# Altium schematic sheet supply_interface.SchDoc
size A4; SheetNumber: 3; SheetTotal: 5
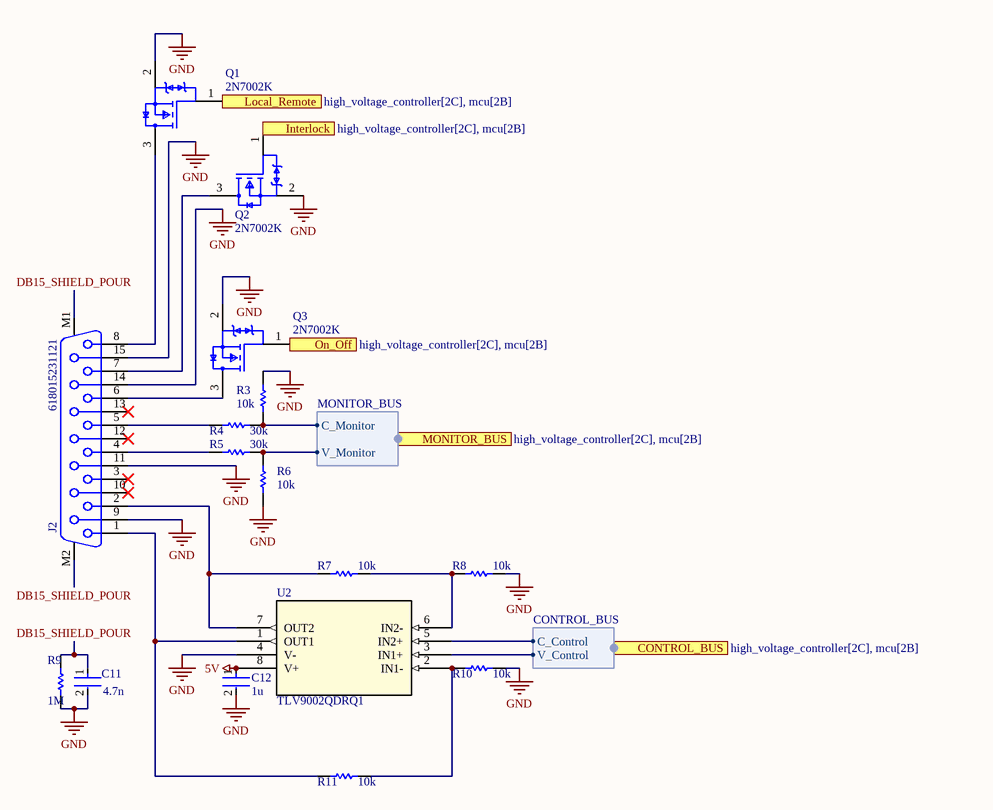
[diagram p0: supply_interface.SchDoc]

## Parts
C11  4.7n  [C_IM 0805]
C12  1u  [C_IM 0603]
J2  618015231121  [618015231121]
Q1  2N7002K  [SOT-23-3]
Q2  2N7002K  [SOT-23-3]
Q3  2N7002K  [SOT-23-3]
R3  10k  [R_IM 0805]
R4  30k  [R_IM 0805]
R5  30k  [R_IM 0805]
R6  10k  [R_IM 0805]
R7  10k  [R_IM 0805]
R8  10k  [R_IM 0805]
R9  1M  [R_IM 0805]
R10  10k  [R_IM 0805]
R11  10k  [R_IM 0805]
U2  TLV9002QDRQ1  [SOIC8_D_TEX]

## Ports
CONTROL_BUS (harness CONTROL_BUS, see high_voltage_controller[2C], mcu[2B]), Interlock (in, see high_voltage_controller[2C], mcu[2B]), Local_Remote (in, see high_voltage_controller[2C], mcu[2B]), MONITOR_BUS (harness MONITOR_BUS, see high_voltage_controller[2C], mcu[2B]), On_Off (in, see high_voltage_controller[2C], mcu[2B])

## Harnesses
MONITOR_BUS: C_Monitor, V_Monitor
CONTROL_BUS: C_Control, V_Control

## Nets
5V: C12.1 U2.8(V+)
GND: C11.2 C12.2 J2.9 J2.11 J2.14 J2.15 Q1.2(Source) Q2.2(Source) Q3.2(Source) R3.2 R6.1 R8.2 R9.1 R10.2 U2.4(V-)
DB15_SHIELD_POUR: C11.1 J2.M1 J2.M2 R9.2
Interlock: Q2.1(Gate) ; port Interlock
Local_Remote: Q1.1(Gate) ; port Local_Remote
On_Off: Q3.1(Gate) ; port On_Off
NetJ2_1: J2.1 R11.1 U2.1(OUT1)
NetJ2_2: J2.2 R7.1 U2.7(OUT2)
NetJ2_4: J2.4 R5.1
NetJ2_5: J2.5 R4.1
NetJ2_6: J2.6 Q3.3(Drain)
NetJ2_7: J2.7 Q2.3(Drain)
NetJ2_8: J2.8 Q1.3(Drain)
NetR3_1: R3.1 R4.2 ; port MONITOR_BUS.C_Monitor
NetR5_2: R5.2 R6.2 ; port MONITOR_BUS.V_Monitor
NetR7_2: R7.2 R8.1 U2.6(IN2-)
NetR10_1: R10.1 R11.2 U2.2(IN1-)
NetU2_3: U2.3(IN1+) ; port CONTROL_BUS.V_Control
NetU2_5: U2.5(IN2+) ; port CONTROL_BUS.C_Control

Not connected (* = marked no-connect by the designer): J2 3* 10* 12* 13*

## Library data of the parts
C11 = C0805C472KDRACAUTO: Cap Ceramic 0.0047uF 1000V X7R 10% Pad SMD 0805 125C Automotive AEC-Q200 Medical T/R; Manufacturer: Yageo Group; Value: 4.7nF; Voltage Rating (DC): 1kV; Supplier: DigiKey; Supplier Part Number: 399-16659-1-ND; Manufacturer Part Number: C0805C472KDRACAUTO; RoHS: Compliant; Category: Ceramic Capacitors; Stock: 30147; Pricing: 1=0.28, 10=0.165, 50=0.1198, 100=0.1059, 500=0.08234, 1000=0.07509 (USD); Case/Package: 0805; China RoHS: Compliant; Country of Origin: Mexico; Dielectric: X7R; Dielectric Material: Ceramic; Export Control Classification Number (ECCN) Code: EAR99; Height: 1.25mm; Harmonized Tariff Schedule (HTS) Code: 8532.24.00.20; Introduction Date: 2012-11-28; Length: 2mm; Lifecycle Status: Production; Max Operating Temperature: 125°C; Min Operating Temperature: -55°C; Mounting Technology: Surface Mount; Number of Terminals: 2; Ratings: AEC-Q200; REACH SVHC: Yes; Schedule B: 8532240020; Width: 1.25mm; ComponentLink1URL: https://datasheet.octopart.com:443/C0805C472KDRACAUTO-KEMET-datasheet-182037894.pdf?src-supplier=IHS; ComponentLink1Description: https://datasheet.octopart.com:443/C0805C472KDRACAUTO-KEMET-datasheet-182037894.pdf?src-supplier=IHS; ComponentLink2URL: https://datasheet.octopart.com:443/C0805C472KDRACAUTO-KEMET-datasheet-149524367.pdf?src-supplier=Farnell; ComponentLink2Description: https://datasheet.octopart.com:443/C0805C472KDRACAUTO-KEMET-datasheet-149524367.pdf?src-supplier=Farnell; ComponentLink3URL: https://datasheet.octopart.com:443/C0805C472KDRACAUTO-KEMET-datasheet-104412827.pdf?src-supplier=element14+APAC; ComponentLink3Description: https://datasheet.octopart.com:443/C0805C472KDRACAUTO-KEMET-datasheet-104412827.pdf?src-supplier=element14+APAC; ComponentLink4URL: https://datasheet.octopart.com:443/C0805C472KDRACAUTO-KEMET-datasheet-176334439.pdf?src-supplier=Newark; ComponentLink4Description: https://datasheet.octopart.com:443/C0805C472KDRACAUTO-KEMET-datasheet-176334439.pdf?src-supplier=Newark; ComponentLink5URL: https://datasheet.octopart.com/C0805C472KDRACAUTO-KEMET-datasheet-84169754.pdf; ComponentLink5Description: https://datasheet.octopart.com/C0805C472KDRACAUTO-KEMET-datasheet-84169754.pdf; Supplier 1: DigiKey; Supplier Part Number 1: 399-16659-1-ND
C12 = CC0603KRX7R7BB105: 16V 1uF X7R ±10% 0603 Multilayer Ceramic Capacitors MLCC - SMD/SMT ROHS; Manufacturer: Yageo Group; Value: 1µF; Dissipation Factor: 5%; Supplier: DigiKey; Supplier Part Number: 311-1446-1-ND; Manufacturer Part Number: CC0603KRX7R7BB105; RoHS: Compliant; Category: Ceramic Capacitors; Stock: 6886746; Pricing: 1=0.13, 10=0.073, 50=0.0508, 100=0.044, 500=0.0327, 1000=0.02922 (USD); Case/Package: 0603; Case Code (Imperial): 0603; Case Code (Metric): 1608; China RoHS: Compliant; Composition: Ceramic; Country of Origin: Mainland China, Taiwan; Depth: 800µm; Dielectric: X7R; Dielectric Material: Ceramic; Export Control Classification Number (ECCN) Code: EAR99; Halogen Free: Halogen Free; Height: 800µm; Harmonized Tariff Schedule (HTS) Code: 8532.24.00.20; Introduction Date: 2009-04-17; Lead Free: Lead Free; Length: 1.6mm; Lifecycle Status: Production; Material: Ceramic; Max Operating Temperature: 125°C; Min Operating Temperature: -55°C; Mounting Technology: Surface Mount; Pins: 2; Number of Terminals: 2; Radiation Hardening: No; REACH SVHC: Yes; Schedule B: 8532240020, 8532240020|8532240020, 8532240020|8532240020|8532240020, 8532240020|8532240020|8532240020|8532240020; Termination: SMD/SMT; Thickness: 889µm; Tolerance: 10%; Voltage: 16V; Voltage Rating: 16V; Voltage Rating (DC): 16V; Width: 800µm; ComponentLink1URL: https://datasheet.octopart.com:443/CC0603KRX7R7BB105-Yageo-datasheet-177165144.pdf?src-supplier=IHS; ComponentLink1Description: https://datasheet.octopart.com:443/CC0603KRX7R7BB105-Yageo-datasheet-177165144.pdf?src-supplier=IHS; ComponentLink2URL: https://datasheet.octopart.com:443/CC0603KRX7R7BB105-Yageo-datasheet-82288757.pdf?src-supplier=Upverter; ComponentLink2Description: https://datasheet.octopart.com:443/CC0603KRX7R7BB105-Yageo-datasheet-82288757.pdf?src-supplier=Upverter; ComponentLink3URL: https://datasheet.octopart.com/CC0603KRX7R7BB105-Yageo-datasheet-10883670.pdf; ComponentLink3Description: https://datasheet.octopart.com/CC0603KRX7R7BB105-Yageo-datasheet-10883670.pdf; ComponentLink4URL: https://datasheet.octopart.com/CC0603KRX7R7BB105-Yageo-datasheet-12526321.pdf; ComponentLink4Description: https://datasheet.octopart.com/CC0603KRX7R7BB105-Yageo-datasheet-12526321.pdf; ComponentLink5URL: https://datasheet.octopart.com:443/CC0603KRX7R7BB105-Yageo-datasheet-181968648.pdf?src-supplier=Newark; ComponentLink5Description: https://datasheet.octopart.com:443/CC0603KRX7R7BB105-Yageo-datasheet-181968648.pdf?src-supplier=Newark; ComponentLink6URL: https://datasheet.octopart.com:443/CC0603KRX7R7BB105-Yageo-datasheet-181968639.pdf?src-supplier=Newark; ComponentLink6Description: https://datasheet.octopart.com:443/CC0603KRX7R7BB105-Yageo-datasheet-181968639.pdf?src-supplier=Newark; ComponentLink7URL: https://datasheet.octopart.com:443/CC0603KRX7R7BB105-Yageo-datasheet-519481.pdf?src-supplier=Newark; ComponentLink7Description: https://datasheet.octopart.com:443/CC0603KRX7R7BB105-Yageo-datasheet-519481.pdf?src-supplier=Newark; ComponentLink8URL: https://datasheet.octopart.com:443/CC0603KRX7R7BB105-Yageo-datasheet-147453679.pdf?src-supplier=Newark; ComponentLink8Description: https://datasheet.octopart.com:443/CC0603KRX7R7BB105-Yageo-datasheet-147453679.pdf?src-supplier=Newark; ComponentLink9URL: https://datasheet.octopart.com:443/CC0603KRX7R7BB105-Yageo-datasheet-62336348.pdf?src-supplier=Farnell; ComponentLink9Description: https://datasheet.octopart.com:443/CC0603KRX7R7BB105-Yageo-datasheet-62336348.pdf?src-supplier=Farnell; ComponentLink10URL: https://datasheet.octopart.com:443/CC0603KRX7R7BB105-Yageo-datasheet-151948686.pdf?src-supplier=Farnell; ComponentLink10Description: https://datasheet.octopart.com:443/CC0603KRX7R7BB105-Yageo-datasheet-151948686.pdf?src-supplier=Farnell; ComponentLink11URL: https://datasheet.octopart.com:443/CC0603KRX7R7BB105-Yageo-datasheet-15895757.pdf?src-supplier=element14+APAC; ComponentLink11Description: https://datasheet.octopart.com:443/CC0603KRX7R7BB105-Yageo-datasheet-15895757.pdf?src-supplier=element14+APAC; ComponentLink12URL: https://datasheet.octopart.com:443/CC0603KRX7R7BB105-Yageo-datasheet-166511530.pdf?src-supplier=Future+Electronics; ComponentLink12Description: https://datasheet.octopart.com:443/CC0603KRX7R7BB105-Yageo-datasheet-166511530.pdf?src-supplier=Future+Electronics; ComponentLink13URL: https://datasheet.octopart.com:443/CC0603KRX7R7BB105-Yageo-datasheet-137700082.pdf?src-supplier=Future+Electronics; ComponentLink13Description: https://datasheet.octopart.com:443/CC0603KRX7R7BB105-Yageo-datasheet-137700082.pdf?src-supplier=Future+Electronics; ComponentLink14URL: https://datasheet.octopart.com:443/CC0603KRX7R7BB105-Yageo-datasheet-137700084.pdf?src-supplier=Future+Electronics; ComponentLink14Description: https://datasheet.octopart.com:443/CC0603KRX7R7BB105-Yageo-datasheet-137700084.pdf?src-supplier=Future+Electronics; ComponentLink15URL: https://datasheet.octopart.com:443/CC0603KRX7R7BB105-Yageo-datasheet-27626582.pdf?src-supplier=Future+Electronics; ComponentLink15Description: https://datasheet.octopart.com:443/CC0603KRX7R7BB105-Yageo-datasheet-27626582.pdf?src-supplier=Future+Electronics; ComponentLink16URL: https://datasheet.octopart.com:443/CC0603KRX7R7BB105-Yageo-Group-datasheet-165992755.pdf?src-supplier=ODG+(Origin+Data+Global); ComponentLink16Description: https://datasheet.octopart.com:443/CC0603KRX7R7BB105-Yageo-Group-datasheet-165992755.pdf?src-supplier=ODG+(Origin+Data+Global); ComponentLink17URL: https://datasheet.octopart.com:443/CC0603KRX7R7BB105-Yageo-datasheet-140260305.pdf?src-supplier=SOS+electronic; ComponentLink17Description: https://datasheet.octopart.com:443/CC0603KRX7R7BB105-Yageo-datasheet-140260305.pdf?src-supplier=SOS+electronic; ComponentLink18URL: https://datasheet.octopart.com:443/CC0603KRX7R7BB105-Yageo-datasheet-8701427.pdf?src-supplier=element14; ComponentLink18Description: https://datasheet.octopart.com:443/CC0603KRX7R7BB105-Yageo-datasheet-8701427.pdf?src-supplier=element14; ComponentLink19URL: https://datasheet.octopart.com:443/CC0603KRX7R7BB105-Yageo-datasheet-499490.pdf?src-supplier=element14; ComponentLink19Description: https://datasheet.octopart.com:443/CC0603KRX7R7BB105-Yageo-datasheet-499490.pdf?src-supplier=element14; ComponentLink20URL: https://datasheet.octopart.com:443/CC0603KRX7R7BB105-Yageo-datasheet-5301394.pdf?src-supplier=element14; ComponentLink20Description: https://datasheet.octopart.com:443/CC0603KRX7R7BB105-Yageo-datasheet-5301394.pdf?src-supplier=element14; ComponentLink21URL: https://datasheet.octopart.com:443/CC0603KRX7R7BB105-Yageo-datasheet-17600895.pdf?src-supplier=TME; ComponentLink21Description: https://datasheet.octopart.com:443/CC0603KRX7R7BB105-Yageo-datasheet-17600895.pdf?src-supplier=TME; ComponentLink22URL: http://sigma.octopart.com:80/rohs_statement/Surface-Mount-Ceramic-Multilayer-Capacitors%3B-General-Purpose-%26-High-Capacitance-Class-2%2C-X7R-Yageo-family-124.pdf?src-supplier=Compliance+Statements; ComponentLink22Description: http://sigma.octopart.com:80/rohs_statement/Surface-Mount-Ceramic-Multilayer-Capacitors%3B-General-Purpose-%26-High-Capacitance-Class-2%2C-X7R-Yageo-family-124.pdf?src-supplier=Compliance+Statements; ComponentLink23URL: http://sigma.octopart.com:80/reach_statement/Surface-Mount-Ceramic-Multilayer-Capacitors%3B-General-Purpose-%26-High-Capacitance-Class-2%2C-X7R-Yageo-family-125.pdf?src-supplier=Compliance+Statements; ComponentLink23Description: http://sigma.octopart.com:80/reach_statement/Surface-Mount-Ceramic-Multilayer-Capacitors%3B-General-Purpose-%26-High-Capacitance-Class-2%2C-X7R-Yageo-family-125.pdf?src-supplier=Compliance+Statements; ComponentLink24URL: http://sigma.octopart.com:80/conflict_mineral_statement/Yageo-company-3.pdf?src-supplier=Compliance+Statements; ComponentLink24Description: http://sigma.octopart.com:80/conflict_mineral_statement/Yageo-company-3.pdf?src-supplier=Compliance+Statements; ComponentLink25URL: http://sigma.octopart.com:80/rohs_statement/Yageo-company-2.pdf?src-supplier=Compliance+Statements; ComponentLink25Description: http://sigma.octopart.com:80/rohs_statement/Yageo-company-2.pdf?src-supplier=Compliance+Statements; Supplier 1: DigiKey; Supplier Part Number 1: 311-1446-1-ND
J2 = 618015231121: 15 Way Right Angle Through Hole Pcb D-sub Connector Socket, 2.77MM, 2.84MM Pitch; Manufacturer: Wurth Elektronik; Manufacturer Lifecycle Status: ACTIVE; Contact Resistance: 30mΩ; Current Rating: 3A; Gender: Female; Insulation Resistance: 5GΩ; Number of Contacts: 15; Operating Supply Voltage: 125V; YEOL: 1 = Estimated lifetime > 10 years; Supplier: DigiKey; Supplier Part Number: 732-618015231121-ND; Manufacturer Part Number: 618015231121; RoHS: Compliant; Category: D-Sub Connectors; Stock: 1853; Pricing: 1=4.07, 10=3.857, 50=3.4296, 100=2.9925, 250=2.565, 500=2.2895 (USD); Contact Plating: Gold; Depth: 18.5mm; Housing Material: Steel; Insulation Material: PBT; Length: 24.8mm; Lifecycle Status: Production; Max Operating Temperature: 105°C; Min Operating Temperature: -55°C; Mounting Technology: Through Hole; Pins: 15; Number of Rows: 2; Orientation: Right Angle; Pitch: 2.77mm; Termination: SMD/SMT; Voltage Rating: 125V; Width: 12.5mm; ComponentLink1URL: https://datasheet.octopart.com:443/618015231121-W%C3%BCrth-Elektronik-datasheet-149524395.pdf?src-supplier=Wurth+Elektronik; ComponentLink1Description: https://datasheet.octopart.com:443/618015231121-W%C3%BCrth-Elektronik-datasheet-149524395.pdf?src-supplier=Wurth+Elektronik; ComponentLink2URL: https://datasheet.octopart.com:443/618015231121-W%C3%BCrth-Elektronik-datasheet-111088018.pdf?src-supplier=Wurth+Elektronik; ComponentLink2Description: https://datasheet.octopart.com:443/618015231121-W%C3%BCrth-Elektronik-datasheet-111088018.pdf?src-supplier=Wurth+Elektronik; ComponentLink3URL: https://datasheet.octopart.com:443/618015231121-W%C3%BCrth-Elektronik-Midcom-datasheet-10410299.pdf?src-supplier=Newark; ComponentLink3Description: https://datasheet.octopart.com:443/618015231121-W%C3%BCrth-Elektronik-Midcom-datasheet-10410299.pdf?src-supplier=Newark; ComponentLink4URL: https://datasheet.octopart.com:443/618015231121-W%C3%BCrth-Elektronik-Midcom-datasheet-10413304.pdf?src-supplier=element14+APAC; ComponentLink4Description: https://datasheet.octopart.com:443/618015231121-W%C3%BCrth-Elektronik-Midcom-datasheet-10413304.pdf?src-supplier=element14+APAC; ComponentLink5URL: https://datasheet.octopart.com:443/618015231121-W%C3%BCrth-Elektronik-Midcom-datasheet-10470155.pdf?src-supplier=element14+APAC; ComponentLink5Description: https://datasheet.octopart.com:443/618015231121-W%C3%BCrth-Elektronik-Midcom-datasheet-10470155.pdf?src-supplier=element14+APAC; ComponentLink6URL: https://datasheet.octopart.com:443/618015231121-W%C3%BCrth-Elektronik-Midcom-datasheet-10489568.pdf?src-supplier=Farnell; ComponentLink6Description: https://datasheet.octopart.com:443/618015231121-W%C3%BCrth-Elektronik-Midcom-datasheet-10489568.pdf?src-supplier=Farnell; Supplier 1: DigiKey; Supplier Part Number 1: 732-618015231121-ND
Q1-Q3 = 2N7002K: Mosfet N-ch 60V 300MA SOT23 / Trans Mosfet N-ch 60V 0.3A 3-PIN SOT-23 T/r; Manufacturer: onsemi; Manufacturer Lifecycle Status: ACTIVE; Continuous Drain Current (ID): 115mA; Current: 3A; Drain to Source Resistance: 2Ω; Element Configuration: Single; Gate to Source Voltage (Vgs): 20V; Input Capacitance: 50pF; Max Junction Temperature (Tj): 150°C; Max Power Dissipation: 350W; Number of Channels: 1; Power Dissipation: 300mW; Value: 2Ω; Threshold Voltage: 2.5V; Turn-Off Delay Time: 55.8ns; Turn-On Delay Time: 12.2ns; Supplier: DigiKey; Supplier Part Number: 2N7002KCT-ND; Manufacturer Part Number: 2N7002K; RoHS: Compliant; Category: MOSFETs; Stock: 393574; Pricing: 1=0.33, 10=0.203, 100=0.1271, 500=0.09384, 1000=0.08309 (USD); Case/Package: SOT-23; China RoHS: Compliant; Contact Plating: Tin; Drain to Source Breakdown Voltage: 60V; Drain to Source Voltage (Vdss): 60V; Height: 1.11mm; Lead Free: Lead Free; Length: 2.92mm; Lifecycle Status: Production; Max Operating Temperature: 150°C; Min Breakdown Voltage: 60V; Min Operating Temperature: -55°C; Mounting Technology: Surface Mount; Number of Elements: 1; Pins: 3; Number of Terminals: 3; Radiation Hardening: No; Rds On Max: 2Ω; REACH SVHC: Yes; Schedule B: 8541210080, 8541210080|8541210080|8541210080|8541210080|8541210080; Voltage: 60V; Width: 1.3mm; ComponentLink1URL: https://datasheet.octopart.com:443/2N7002K-onsemi-datasheet-180957336.pdf?src-supplier=IHS; ComponentLink1Description: https://datasheet.octopart.com:443/2N7002K-onsemi-datasheet-180957336.pdf?src-supplier=IHS; ComponentLink2URL: https://datasheet.octopart.com:443/2N7002K-Fairchild-Semiconductor-datasheet-34208596.pdf?src-supplier=IHS; ComponentLink2Description: https://datasheet.octopart.com:443/2N7002K-Fairchild-Semiconductor-datasheet-34208596.pdf?src-supplier=IHS; ComponentLink3URL: https://datasheet.octopart.com:443/2N7002K-ON-Semiconductor-datasheet-138897972.pdf?src-supplier=onsemi; ComponentLink3Description: https://datasheet.octopart.com:443/2N7002K-ON-Semiconductor-datasheet-138897972.pdf?src-supplier=onsemi; ComponentLink4URL: https://datasheet.octopart.com:443/2N7002K-ON-Semiconductor-datasheet-147841327.pdf?src-supplier=onsemi; ComponentLink4Description: https://datasheet.octopart.com:443/2N7002K-ON-Semiconductor-datasheet-147841327.pdf?src-supplier=onsemi; ComponentLink5URL: https://datasheet.octopart.com:443/2N7002K-ON-Semiconductor-datasheet-81464098.pdf?src-supplier=onsemi; ComponentLink5Description: https://datasheet.octopart.com:443/2N7002K-ON-Semiconductor-datasheet-81464098.pdf?src-supplier=onsemi; ComponentLink6URL: https://datasheet.octopart.com:443/2N7002K-ON-Semiconductor-datasheet-8636720.pdf?src-supplier=onsemi; ComponentLink6Description: https://datasheet.octopart.com:443/2N7002K-ON-Semiconductor-datasheet-8636720.pdf?src-supplier=onsemi; ComponentLink7URL: https://sigma.octopart.com:443/138897241/technical_drawing/ON-Semiconductor-2N7002K.pdf?src-supplier=Upverter; ComponentLink7Description: https://sigma.octopart.com:443/138897241/technical_drawing/ON-Semiconductor-2N7002K.pdf?src-supplier=Upverter; ComponentLink8URL: https://datasheet.octopart.com:443/2N7002K-ON-Semiconductor-datasheet-13704821.pdf?src-supplier=element14+APAC; ComponentLink8Description: https://datasheet.octopart.com:443/2N7002K-ON-Semiconductor-datasheet-13704821.pdf?src-supplier=element14+APAC; ComponentLink9URL: https://datasheet.octopart.com:443/2N7002K-ON-Semiconductor-datasheet-86682065.pdf?src-supplier=element14+APAC; ComponentLink9Description: https://datasheet.octopart.com:443/2N7002K-ON-Semiconductor-datasheet-86682065.pdf?src-supplier=element14+APAC; ComponentLink10URL: https://datasheet.octopart.com:443/2N7002K-onsemi-datasheet-181958640.pdf?src-supplier=Newark; ComponentLink10Description: https://datasheet.octopart.com:443/2N7002K-onsemi-datasheet-181958640.pdf?src-supplier=Newark; ComponentLink11URL: https://datasheet.octopart.com:443/2N7002K-Fairchild-Semiconductor-datasheet-67650041.pdf?src-supplier=Newark; ComponentLink11Description: https://datasheet.octopart.com:443/2N7002K-Fairchild-Semiconductor-datasheet-67650041.pdf?src-supplier=Newark; ComponentLink12URL: https://datasheet.octopart.com:443/2N7002K-Fairchild-Semiconductor-datasheet-68365086.pdf?src-supplier=Newark; ComponentLink12Description: https://datasheet.octopart.com:443/2N7002K-Fairchild-Semiconductor-datasheet-68365086.pdf?src-supplier=Newark; ComponentLink13URL: https://datasheet.octopart.com:443/2N7002K-Fairchild-Semiconductor-datasheet-68558619.pdf?src-supplier=Newark; ComponentLink13Description: https://datasheet.octopart.com:443/2N7002K-Fairchild-Semiconductor-datasheet-68558619.pdf?src-supplier=Newark; ComponentLink14URL: https://datasheet.octopart.com:443/2N7002K-ON-Semiconductor-datasheet-137315652.pdf?src-supplier=Future+Electronics; ComponentLink14Description: https://datasheet.octopart.com:443/2N7002K-ON-Semiconductor-datasheet-137315652.pdf?src-supplier=Future+Electronics; ComponentLink15URL: https://sigma.octopart.com:443/17343971/technical_drawing/Fairchild-Semiconductor-2N7002K.pdf?src-supplier=Fairchild+Semiconductor; ComponentLink15Description: https://sigma.octopart.com:443/17343971/technical_drawing/Fairchild-Semiconductor-2N7002K.pdf?src-supplier=Fairchild+Semiconductor; ComponentLink16URL: https://datasheet.octopart.com:443/2N7002K-Fairchild-Semiconductor-datasheet-67878677.pdf?src-supplier=Farnell; ComponentLink16Description: https://datasheet.octopart.com:443/2N7002K-Fairchild-Semiconductor-datasheet-67878677.pdf?src-supplier=Farnell; ComponentLink17URL: https://datasheet.octopart.com:443/2N7002K-Fairchild-Semiconductor-datasheet-68650436.pdf?src-supplier=Farnell; ComponentLink17Description: https://datasheet.octopart.com:443/2N7002K-Fairchild-Semiconductor-datasheet-68650436.pdf?src-supplier=Farnell; ComponentLink18URL: https://datasheet.octopart.com:443/2N7002K-Fairchild-Semiconductor-datasheet-78857226.pdf?src-supplier=Farnell; ComponentLink18Description: https://datasheet.octopart.com:443/2N7002K-Fairchild-Semiconductor-datasheet-78857226.pdf?src-supplier=Farnell; ComponentLink19URL: http://sigma.octopart.com:80/150600003/rohs_statement/ON-Semiconductor-2N7002K.pdf?src-supplier=Compliance+Statements; ComponentLink19Description: http://sigma.octopart.com:80/150600003/rohs_statement/ON-Semiconductor-2N7002K.pdf?src-supplier=Compliance+Statements; ComponentLink20URL: http://sigma.octopart.com:80/17343977/reach_statement/Fairchild-Semiconductor-2N7002K.pdf?src-supplier=Compliance+Statements; ComponentLink20Description: http://sigma.octopart.com:80/17343977/reach_statement/Fairchild-Semiconductor-2N7002K.pdf?src-supplier=Compliance+Statements; ComponentLink21URL: http://sigma.octopart.com:80/17343978/materials_sheet/Fairchild-Semiconductor-2N7002K.pdf?src-supplier=Compliance+Statements; ComponentLink21Description: http://sigma.octopart.com:80/17343978/materials_sheet/Fairchild-Semiconductor-2N7002K.pdf?src-supplier=Compliance+Statements; ComponentLink22URL: http://sigma.octopart.com:80/33036988/materials_sheet/Fairchild-Semiconductor-2N7002K.pdf?src-supplier=Compliance+Statements; ComponentLink22Description: http://sigma.octopart.com:80/33036988/materials_sheet/Fairchild-Semiconductor-2N7002K.pdf?src-supplier=Compliance+Statements; ComponentLink23URL: http://sigma.octopart.com:80/33036987/reach_statement/Fairchild-Semiconductor-2N7002K.pdf?src-supplier=Compliance+Statements; ComponentLink23Description: http://sigma.octopart.com:80/33036987/reach_statement/Fairchild-Semiconductor-2N7002K.pdf?src-supplier=Compliance+Statements; ComponentLink24URL: http://sigma.octopart.com:80/reach_statement/ON-Semiconductor-company-79.pdf?src-supplier=Compliance+Statements; ComponentLink24Description: http://sigma.octopart.com:80/reach_statement/ON-Semiconductor-company-79.pdf?src-supplier=Compliance+Statements; ComponentLink25URL: http://sigma.octopart.com:80/rohs_statement/Fairchild-Semiconductor-company-11.pdf?src-supplier=Compliance+Statements; ComponentLink25Description: http://sigma.octopart.com:80/rohs_statement/Fairchild-Semiconductor-company-11.pdf?src-supplier=Compliance+Statements; ComponentLink26URL: http://sigma.octopart.com:80/rohs_statement/Fairchild-Semiconductor-company-10.pdf?src-supplier=Compliance+Statements; ComponentLink26Description: http://sigma.octopart.com:80/rohs_statement/Fairchild-Semiconductor-company-10.pdf?src-supplier=Compliance+Statements; ComponentLink27URL: http://sigma.octopart.com:80/reach_statement/Fairchild-Semiconductor-company-9.pdf?src-supplier=Compliance+Statements; ComponentLink27Description: http://sigma.octopart.com:80/reach_statement/Fairchild-Semiconductor-company-9.pdf?src-supplier=Compliance+Statements; ComponentLink28URL: https://octopart.com:443/opatz8j6/c1?t=nm5kdMlbaAnwpklrVZblZ0nE71AQlgwh7ERqQoEJhKvEfgRp_9FXj7IMoPPC8V_j13LWXOpO2Jxw4bOkneI3J4oQ-Ueqca9fxYR6kFJosDJCZUuoEPm8PptoZzKZNXIWwYdL1v0f_3jxmMMd6AmYg9Y7R4OLdY3QL6Rk6u6ai-3ss5V1K0SdYAJs7A9F18xCMj7KK3OJ0kjjq8to-n9XtuWqv7DBv7T5vrdVNUg03mJ5ApziGpyAB5Qe7qbvoVw8pQA7F0WEglJk1PRa4-p6s3a5dQiLDUC_bYLpYK_Y4Yhi_XqAGpD62eBhzZC41UC6OOQBzi0Qvg0NEKn45CaGve0MJuREN5MOXiQU&src-supplier=Compliance+Statements; ComponentLink28Description: https://octopart.com:443/opatz8j6/c1?t=nm5kdMlbaAnwpklrVZblZ0nE71AQlgwh7ERqQoEJhKvEfgRp_9FXj7IMoPPC8V_j13LWXOpO2Jxw4bOkneI3J4oQ-Ueqca9fxYR6kFJosDJCZUuoEPm8PptoZzKZNXIWwYdL1v0f_3jxmMMd6AmYg9Y7R4OLdY3QL6Rk6u6ai-3ss5V1K0SdYAJs7A9F18xCMj7KK3OJ0kjjq8to-n9XtuWqv7DBv7T5vrdVNUg03mJ5ApziGpyAB5Qe7qbvoVw8pQA7F0WEglJk1PRa4-p6s3a5dQiLDUC_bYLpYK_Y4Yhi_XqAGpD62eBhzZC41UC6OOQBzi0Qvg0NEKn45CaGve0MJuREN5MOXiQU&src-supplier=Compliance+Statements; ComponentLink29URL: https://octopart.com:443/opatz8j6/c1?t=yP1dprRIHwIgdvtjb9FYqRaP3_9HWgrBaL9JkhjecsSuf0n6cINMsFwp5N6FMygctrzVDOAIh4pqo1B7NhLuP4EfhfgMmii0srxvh2XxIZc2UWh74_aW-dJirl-sIPHhCpS4y3FsLHcYkfI7uz7Zobk3yF8mMTCkQ2uO5Ev9E03_1hZh6X3YtwOYI82JGjIbo8QvUN_FXJ9Womd2nii1m-sUjS3nWbw_QaYVMn5ZbNRqutWyxY-yUPVqm24VyLJbSNi-am4bjCcC6TDsH0hBYj3fGvqNFGx_58D2X5w3EoEA4KlvTi0mcDs5gj__gSGJCxXMmsSQPns7LYMZtqXHHcrx3ZG_xUyLjZk&src-supplier=Compliance+Statements; ComponentLink29Description: https://octopart.com:443/opatz8j6/c1?t=yP1dprRIHwIgdvtjb9FYqRaP3_9HWgrBaL9JkhjecsSuf0n6cINMsFwp5N6FMygctrzVDOAIh4pqo1B7NhLuP4EfhfgMmii0srxvh2XxIZc2UWh74_aW-dJirl-sIPHhCpS4y3FsLHcYkfI7uz7Zobk3yF8mMTCkQ2uO5Ev9E03_1hZh6X3YtwOYI82JGjIbo8QvUN_FXJ9Womd2nii1m-sUjS3nWbw_QaYVMn5ZbNRqutWyxY-yUPVqm24VyLJbSNi-am4bjCcC6TDsH0hBYj3fGvqNFGx_58D2X5w3EoEA4KlvTi0mcDs5gj__gSGJCxXMmsSQPns7LYMZtqXHHcrx3ZG_xUyLjZk&src-supplier=Compliance+Statements; Supplier 1: DigiKey; Supplier Part Number 1: 2N7002KCT-ND
R3 R6-R8 R10 R11 = RC0805FR-0710KL: Res General Purpose Thick Film 0805 10k Ohm 1% 1/8W ±100ppm/°C Ceramic Paper T/R; Manufacturer: Yageo Group; Max Power Dissipation: 125mW; Value: 10kΩ; Voltage Rating: 150V; Supplier: DigiKey; Supplier Part Number: 311-10.0KCRCT-ND; Manufacturer Part Number: RC0805FR-0710KL; RoHS: Compliant; Category: Chip SMD Resistors; Stock: 4083661; Pricing: 1=0.1, 10=0.034, 25=0.0256, 50=0.0208, 100=0.0171, 250=0.01344, 500=0.01136, 1000=0.00973 (USD); Case/Package: 0805; Case Code (Imperial): 0805; China RoHS: Non-Compliant; Composition: Thick Film; Contact Plating: Tin; Country of Origin: Mainland China, Taiwan; Depth: 1.25mm; Export Control Classification Number (ECCN) Code: EAR99; Features: Moisture Resistant; Height: 500µm; Harmonized Tariff Schedule (HTS) Code: 8533.21.00.30; Introduction Date: 2004-09-22; Lead Free: Lead Free; Length: 2mm; Lifecycle Status: Production; Max Operating Temperature: 155°C; Military Standard: Not; Min Operating Temperature: -55°C; Mounting Technology: Surface Mount; Pins: 2; Number of Terminals: 2; Number of Terminations: 2; Packaging: Tape and Reel; Power Rating: 125mW; Radiation Hardening: No; REACH SVHC: Yes; Schedule B: 8533210045, 8533210045|8533210045|8533210045|8533210045|8533210045|8533210045|8533210045|8533210045|8533210045|8533210045|8533210045|8533210045|8533210045|8533210045|8533210045|8533210045|8533210045|8533210045|8533210045|8533210045|8533210045|8533210045|8533210045|85; Temperature Coefficient: 100ppm/°C; Termination: SMD/SMT; Tolerance: 1%; Voltage Rating (AC): 150V; Voltage Rating (DC): 150V; Width: 1.25mm; Working Voltage: 150V; ComponentLink1URL: https://datasheet.octopart.com:443/RC0805FR-0710KL-Yageo-datasheet-175887523.pdf?src-supplier=Newark; ComponentLink1Description: https://datasheet.octopart.com:443/RC0805FR-0710KL-Yageo-datasheet-175887523.pdf?src-supplier=Newark; ComponentLink2URL: https://datasheet.octopart.com:443/RC0805FR-0710KL-Yageo-datasheet-62067350.pdf?src-supplier=Farnell; ComponentLink2Description: https://datasheet.octopart.com:443/RC0805FR-0710KL-Yageo-datasheet-62067350.pdf?src-supplier=Farnell; ComponentLink3URL: https://datasheet.octopart.com:443/RC0805FR-0710KL-Yageo-datasheet-13691069.pdf?src-supplier=Farnell; ComponentLink3Description: https://datasheet.octopart.com:443/RC0805FR-0710KL-Yageo-datasheet-13691069.pdf?src-supplier=Farnell; ComponentLink4URL: https://datasheet.octopart.com:443/RC0805FR-0710KL-Yageo-datasheet-103092701.pdf?src-supplier=Upverter; ComponentLink4Description: https://datasheet.octopart.com:443/RC0805FR-0710KL-Yageo-datasheet-103092701.pdf?src-supplier=Upverter; ComponentLink5URL: https://datasheet.octopart.com:443/RC0805FR-0710KL-Yageo-datasheet-98239111.pdf?src-supplier=Upverter; ComponentLink5Description: https://datasheet.octopart.com:443/RC0805FR-0710KL-Yageo-datasheet-98239111.pdf?src-supplier=Upverter; ComponentLink6URL: https://datasheet.octopart.com:443/RC0805FR-0710KL-Yageo---Phycomp-datasheet-67302840.pdf?src-supplier=Upverter; ComponentLink6Description: https://datasheet.octopart.com:443/RC0805FR-0710KL-Yageo---Phycomp-datasheet-67302840.pdf?src-supplier=Upverter; ComponentLink7URL: https://datasheet.octopart.com:443/RC0805FR-0710KL-Yageo-datasheet-8330313.pdf?src-supplier=element14+APAC; ComponentLink7Description: https://datasheet.octopart.com:443/RC0805FR-0710KL-Yageo-datasheet-8330313.pdf?src-supplier=element14+APAC; ComponentLink8URL: https://datasheet.octopart.com:443/RC0805FR-0710KL-Yageo-datasheet-12592811.pdf?src-supplier=element14+APAC; ComponentLink8Description: https://datasheet.octopart.com:443/RC0805FR-0710KL-Yageo-datasheet-12592811.pdf?src-supplier=element14+APAC; ComponentLink9URL: https://datasheet.octopart.com:443/RC0805FR-0710KL-Yageo-Group-datasheet-190305687.pdf?src-supplier=Future+Electronics; ComponentLink9Description: https://datasheet.octopart.com:443/RC0805FR-0710KL-Yageo-Group-datasheet-190305687.pdf?src-supplier=Future+Electronics; ComponentLink10URL: https://datasheet.octopart.com:443/RC0805FR-0710KL-Yageo-datasheet-164759695.pdf?src-supplier=Future+Electronics; ComponentLink10Description: https://datasheet.octopart.com:443/RC0805FR-0710KL-Yageo-datasheet-164759695.pdf?src-supplier=Future+Electronics; ComponentLink11URL: https://datasheet.octopart.com:443/RC0805FR-0710KL-Yageo-datasheet-15800360.pdf?src-supplier=Future+Electronics; ComponentLink11Description: https://datasheet.octopart.com:443/RC0805FR-0710KL-Yageo-datasheet-15800360.pdf?src-supplier=Future+Electronics; ComponentLink12URL: https://datasheet.octopart.com:443/RC0805FR-0710KL-Yageo-datasheet-8324252.pdf?src-supplier=Future+Electronics; ComponentLink12Description: https://datasheet.octopart.com:443/RC0805FR-0710KL-Yageo-datasheet-8324252.pdf?src-supplier=Future+Electronics; ComponentLink13URL: https://datasheet.octopart.com:443/RC0805FR-0710KL-Yageo-datasheet-79472498.pdf?src-supplier=Megastar; ComponentLink13Description: https://datasheet.octopart.com:443/RC0805FR-0710KL-Yageo-datasheet-79472498.pdf?src-supplier=Megastar; ComponentLink14URL: https://datasheet.octopart.com:443/RC0805FR-0710KL-Yageo-datasheet-27714392.pdf?src-supplier=Seeed+Studio; ComponentLink14Description: https://datasheet.octopart.com:443/RC0805FR-0710KL-Yageo-datasheet-27714392.pdf?src-supplier=Seeed+Studio; ComponentLink15URL: https://datasheet.octopart.com/RC0805FR-0710KL-Yageo-datasheet-73766026.pdf; ComponentLink15Description: https://datasheet.octopart.com/RC0805FR-0710KL-Yageo-datasheet-73766026.pdf; ComponentLink16URL: https://datasheet.octopart.com:443/RC0805FR-0710KL-Yageo-datasheet-118657.pdf?src-supplier=DigiKey; ComponentLink16Description: https://datasheet.octopart.com:443/RC0805FR-0710KL-Yageo-datasheet-118657.pdf?src-supplier=DigiKey; ComponentLink17URL: https://datasheet.octopart.com:443/RC0805FR-0710KL-Yageo-datasheet-502840.pdf?src-supplier=element14; ComponentLink17Description: https://datasheet.octopart.com:443/RC0805FR-0710KL-Yageo-datasheet-502840.pdf?src-supplier=element14; ComponentLink18URL: http://sigma.octopart.com:80/conflict_mineral_statement/Yageo-company-3.pdf?src-supplier=Compliance+Statements; ComponentLink18Description: http://sigma.octopart.com:80/conflict_mineral_statement/Yageo-company-3.pdf?src-supplier=Compliance+Statements; ComponentLink19URL: http://sigma.octopart.com:80/rohs_statement/Yageo-company-2.pdf?src-supplier=Compliance+Statements; ComponentLink19Description: http://sigma.octopart.com:80/rohs_statement/Yageo-company-2.pdf?src-supplier=Compliance+Statements; Supplier 1: DigiKey; Supplier Part Number 1: 311-10.0KCRCT-ND
R4 R5 = RC0805FR-0730KL: 125mW Thick Film Resistors 150V ±100ppm/℃ ±1% 30kΩ 0805 Chip Resistor - Surface Mount ROHS; Manufacturer: Yageo Group; Temperature Coefficient: 100ppm/°C; Supplier: DigiKey; Supplier Part Number: 311-30.0KCRCT-ND; Manufacturer Part Number: RC0805FR-0730KL; RoHS: Compliant; Category: Chip SMD Resistors; Stock: 231540; Pricing: 1=0.1, 10=0.034, 25=0.0256, 50=0.0208, 100=0.0171, 250=0.01344, 500=0.01136, 1000=0.00973 (USD); Case/Package: 0805; Case Code (Imperial): 0805; China RoHS: Non-Compliant; Composition: Thick Film; Country of Origin: Mainland China, Taiwan; Depth: 1.25mm; Export Control Classification Number (ECCN) Code: EAR99; Features: Moisture Resistant; Height: 500µm; Harmonized Tariff Schedule (HTS) Code: 8533.21.00.30; Introduction Date: 2008-07-18; Lead Free: Lead Free; Length: 2mm; Lifecycle Status: Production; Max Operating Temperature: 155°C; Max Power Dissipation: 125mW; Military Standard: Not; Min Operating Temperature: -55°C; Mounting Technology: Surface Mount; Number of Terminals: 2; Number of Terminations: 2; Packaging: Tape & Reel; Power Rating: 125mW; REACH SVHC: Yes; Value: 30kΩ; Schedule B: 8533210045, 8533210045|8533210045, 8533210045|8533210045|8533210045, 8533210045|8533210045|8533210045|8533210045; Termination: SMD/SMT; Tolerance: 1%; Voltage Rating: 150V; Voltage Rating (DC): 150V; Width: 1.25mm; Working Voltage: 150V; ComponentLink1URL: https://datasheet.octopart.com:443/RC0805FR-0730KL-Yageo-datasheet-175887523.pdf?src-supplier=Newark; ComponentLink1Description: https://datasheet.octopart.com:443/RC0805FR-0730KL-Yageo-datasheet-175887523.pdf?src-supplier=Newark; ComponentLink2URL: https://datasheet.octopart.com:443/RC0805FR-0730KL-Yageo-datasheet-103092701.pdf?src-supplier=Upverter; ComponentLink2Description: https://datasheet.octopart.com:443/RC0805FR-0730KL-Yageo-datasheet-103092701.pdf?src-supplier=Upverter; ComponentLink3URL: https://datasheet.octopart.com:443/RC0805FR-0730KL-Yageo-Group-datasheet-190305687.pdf?src-supplier=Future+Electronics; ComponentLink3Description: https://datasheet.octopart.com:443/RC0805FR-0730KL-Yageo-Group-datasheet-190305687.pdf?src-supplier=Future+Electronics; ComponentLink4URL: https://datasheet.octopart.com:443/RC0805FR-0730KL-Yageo-datasheet-8330313.pdf?src-supplier=Future+Electronics; ComponentLink4Description: https://datasheet.octopart.com:443/RC0805FR-0730KL-Yageo-datasheet-8330313.pdf?src-supplier=Future+Electronics; ComponentLink5URL: https://datasheet.octopart.com:443/RC0805FR-0730KL-Yageo-datasheet-164759695.pdf?src-supplier=Future+Electronics; ComponentLink5Description: https://datasheet.octopart.com:443/RC0805FR-0730KL-Yageo-datasheet-164759695.pdf?src-supplier=Future+Electronics; ComponentLink6URL: https://datasheet.octopart.com:443/RC0805FR-0730KL-Yageo-datasheet-12592811.pdf?src-supplier=Future+Electronics; ComponentLink6Description: https://datasheet.octopart.com:443/RC0805FR-0730KL-Yageo-datasheet-12592811.pdf?src-supplier=Future+Electronics; ComponentLink7URL: https://datasheet.octopart.com:443/RC0805FR-0730KL-Yageo-datasheet-8324252.pdf?src-supplier=Future+Electronics; ComponentLink7Description: https://datasheet.octopart.com:443/RC0805FR-0730KL-Yageo-datasheet-8324252.pdf?src-supplier=Future+Electronics; ComponentLink8URL: https://datasheet.octopart.com:443/RC0805FR-0730KL-Yageo-Group-datasheet-189192902.pdf?src-supplier=LCSC; ComponentLink8Description: https://datasheet.octopart.com:443/RC0805FR-0730KL-Yageo-Group-datasheet-189192902.pdf?src-supplier=LCSC; ComponentLink9URL: https://datasheet.octopart.com:443/RC0805FR-0730KL-Yageo-datasheet-148775077.pdf?src-supplier=TME; ComponentLink9Description: https://datasheet.octopart.com:443/RC0805FR-0730KL-Yageo-datasheet-148775077.pdf?src-supplier=TME; ComponentLink10URL: https://datasheet.octopart.com:443/RC0805FR-0730KL-Yageo-datasheet-79472498.pdf?src-supplier=Megastar; ComponentLink10Description: https://datasheet.octopart.com:443/RC0805FR-0730KL-Yageo-datasheet-79472498.pdf?src-supplier=Megastar; ComponentLink11URL: https://datasheet.octopart.com/RC0805FR-0730KL-Yageo-datasheet-73766026.pdf; ComponentLink11Description: https://datasheet.octopart.com/RC0805FR-0730KL-Yageo-datasheet-73766026.pdf; ComponentLink12URL: https://datasheet.octopart.com:443/RC0805FR-0730KL-Yageo-datasheet-118657.pdf?src-supplier=DigiKey; ComponentLink12Description: https://datasheet.octopart.com:443/RC0805FR-0730KL-Yageo-datasheet-118657.pdf?src-supplier=DigiKey; ComponentLink13URL: http://sigma.octopart.com:80/conflict_mineral_statement/Yageo-company-3.pdf?src-supplier=Compliance+Statements; ComponentLink13Description: http://sigma.octopart.com:80/conflict_mineral_statement/Yageo-company-3.pdf?src-supplier=Compliance+Statements; ComponentLink14URL: http://sigma.octopart.com:80/rohs_statement/Yageo-company-2.pdf?src-supplier=Compliance+Statements; ComponentLink14Description: http://sigma.octopart.com:80/rohs_statement/Yageo-company-2.pdf?src-supplier=Compliance+Statements; Supplier 1: DigiKey; Supplier Part Number 1: 311-30.0KCRCT-ND
R9 = RC0603FR-071ML: Res Thick Film 0603 1M Ohm 1% 0.1W(1/10W) ±100ppm/°C Pad SMD T/R / RES SMD 1M OHM 1% 1/10W 0603; Manufacturer: Yageo Group; Value: 1mF; Power Rating: 100mW; Voltage Rating: 25V; Working Voltage: 75V; Supplier: DigiKey; Supplier Part Number: 311-1.00MHRCT-ND; Manufacturer Part Number: RC0603FR-071ML; RoHS: Compliant; Category: Chip SMD Resistors; Stock: 484489; Pricing: 1=0.1, 10=0.025, 25=0.0188, 50=0.015, 100=0.0122, 250=0.0094, 500=0.00782, 1000=0.00661 (USD); Case/Package: 0603; Case Code (Imperial): 0603; Case Code (Metric): 0603; China RoHS: Non-Compliant; Composition: Thick Film; Country of Origin: Mainland China, Taiwan; Depth: 800µm; Diameter: 10mm; Export Control Classification Number (ECCN) Code: EAR99; Height: 450µm; Harmonized Tariff Schedule (HTS) Code: 8533.21.00.30; Introduction Date: 2004-10-04; Lead Free: Lead Free; Lead Pitch: 5mm; Length: 1.6mm; Lifecycle Status: Production; Max Operating Temperature: 155°C; Military Standard: Not; Min Operating Temperature: -55°C; Mounting Technology: Surface Mount; Pins: 2; Number of Terminals: 2; Packaging: Bulk; Radiation Hardening: No; REACH SVHC: Yes; Schedule B: 8533210045, 8533210045|8533210045|8533210045|8533210045|8533210045|8533210045|8533210045|8533210045|8533210045|8533210045|8533210045|8533210045|8533210045|8533210045|8533210045|8533210045|8533210045|8533210045|8533210045|8533210045|8533210045|8533210045|8533210045|85; Temperature Coefficient: 100ppm/°C; Termination: SMD/SMT; Tolerance: 1%; Voltage Rating (DC): 25V; Width: 800µm; ComponentLink1URL: https://datasheet.octopart.com:443/RC0603FR-071ML-Yageo-datasheet-175887523.pdf?src-supplier=Newark; ComponentLink1Description: https://datasheet.octopart.com:443/RC0603FR-071ML-Yageo-datasheet-175887523.pdf?src-supplier=Newark; ComponentLink2URL: https://datasheet.octopart.com:443/RC0603FR-071ML-Yageo-datasheet-34211833.pdf?src-supplier=Newark; ComponentLink2Description: https://datasheet.octopart.com:443/RC0603FR-071ML-Yageo-datasheet-34211833.pdf?src-supplier=Newark; ComponentLink3URL: https://datasheet.octopart.com:443/RC0603FR-071ML-Yageo-datasheet-8328172.pdf?src-supplier=element14+APAC; ComponentLink3Description: https://datasheet.octopart.com:443/RC0603FR-071ML-Yageo-datasheet-8328172.pdf?src-supplier=element14+APAC; ComponentLink4URL: https://datasheet.octopart.com:443/RC0603FR-071ML-Yageo-datasheet-17842380.pdf?src-supplier=element14+APAC; ComponentLink4Description: https://datasheet.octopart.com:443/RC0603FR-071ML-Yageo-datasheet-17842380.pdf?src-supplier=element14+APAC; ComponentLink5URL: https://datasheet.octopart.com:443/RC0603FR-071ML-Yageo-datasheet-62067350.pdf?src-supplier=Farnell; ComponentLink5Description: https://datasheet.octopart.com:443/RC0603FR-071ML-Yageo-datasheet-62067350.pdf?src-supplier=Farnell; ComponentLink6URL: https://datasheet.octopart.com:443/RC0603FR-071ML-Yageo-datasheet-13691069.pdf?src-supplier=Farnell; ComponentLink6Description: https://datasheet.octopart.com:443/RC0603FR-071ML-Yageo-datasheet-13691069.pdf?src-supplier=Farnell; ComponentLink7URL: https://datasheet.octopart.com:443/RC0603FR-071ML-Yageo-datasheet-103092701.pdf?src-supplier=Upverter; ComponentLink7Description: https://datasheet.octopart.com:443/RC0603FR-071ML-Yageo-datasheet-103092701.pdf?src-supplier=Upverter; ComponentLink8URL: https://datasheet.octopart.com:443/RC0603FR-071ML-Yageo-datasheet-79472498.pdf?src-supplier=Upverter; ComponentLink8Description: https://datasheet.octopart.com:443/RC0603FR-071ML-Yageo-datasheet-79472498.pdf?src-supplier=Upverter; ComponentLink9URL: https://datasheet.octopart.com:443/RC0603FR-071ML-Yageo-Group-datasheet-176638170.pdf?src-supplier=Future+Electronics; ComponentLink9Description: https://datasheet.octopart.com:443/RC0603FR-071ML-Yageo-Group-datasheet-176638170.pdf?src-supplier=Future+Electronics; ComponentLink10URL: https://datasheet.octopart.com:443/RC0603FR-071ML-Yageo-datasheet-164759695.pdf?src-supplier=Future+Electronics; ComponentLink10Description: https://datasheet.octopart.com:443/RC0603FR-071ML-Yageo-datasheet-164759695.pdf?src-supplier=Future+Electronics; ComponentLink11URL: https://datasheet.octopart.com:443/RC0603FR-071ML-Yageo-datasheet-137700087.pdf?src-supplier=Future+Electronics; ComponentLink11Description: https://datasheet.octopart.com:443/RC0603FR-071ML-Yageo-datasheet-137700087.pdf?src-supplier=Future+Electronics; ComponentLink12URL: https://datasheet.octopart.com:443/RC0603FR-071ML-Yageo-datasheet-27584510.pdf?src-supplier=Future+Electronics; ComponentLink12Description: https://datasheet.octopart.com:443/RC0603FR-071ML-Yageo-datasheet-27584510.pdf?src-supplier=Future+Electronics; ComponentLink13URL: https://datasheet.octopart.com:443/RC0603FR-071ML-Yageo-datasheet-15599030.pdf?src-supplier=Future+Electronics; ComponentLink13Description: https://datasheet.octopart.com:443/RC0603FR-071ML-Yageo-datasheet-15599030.pdf?src-supplier=Future+Electronics; ComponentLink14URL: https://datasheet.octopart.com:443/RC0603FR-071ML-Yageo-datasheet-12596169.pdf?src-supplier=Future+Electronics; ComponentLink14Description: https://datasheet.octopart.com:443/RC0603FR-071ML-Yageo-datasheet-12596169.pdf?src-supplier=Future+Electronics; ComponentLink15URL: https://datasheet.octopart.com:443/RC0603FR-071ML-Yageo-datasheet-8324193.pdf?src-supplier=Future+Electronics; ComponentLink15Description: https://datasheet.octopart.com:443/RC0603FR-071ML-Yageo-datasheet-8324193.pdf?src-supplier=Future+Electronics; ComponentLink16URL: https://datasheet.octopart.com/RC0603FR-071ML-Yageo-datasheet-73766026.pdf; ComponentLink16Description: https://datasheet.octopart.com/RC0603FR-071ML-Yageo-datasheet-73766026.pdf; ComponentLink17URL: https://datasheet.octopart.com:443/RC0603FR-071ML-Yageo-datasheet-30459151.pdf?src-supplier=Seeed+Studio; ComponentLink17Description: https://datasheet.octopart.com:443/RC0603FR-071ML-Yageo-datasheet-30459151.pdf?src-supplier=Seeed+Studio; ComponentLink18URL: https://datasheet.octopart.com:443/RC0603FR-071ML-Yageo-datasheet-118562.pdf?src-supplier=DigiKey; ComponentLink18Description: https://datasheet.octopart.com:443/RC0603FR-071ML-Yageo-datasheet-118562.pdf?src-supplier=DigiKey; ComponentLink19URL: https://datasheet.octopart.com:443/RC0603FR-071ML-Yageo-datasheet-503470.pdf?src-supplier=element14; ComponentLink19Description: https://datasheet.octopart.com:443/RC0603FR-071ML-Yageo-datasheet-503470.pdf?src-supplier=element14; ComponentLink20URL: http://sigma.octopart.com:80/conflict_mineral_statement/Yageo-company-3.pdf?src-supplier=Compliance+Statements; ComponentLink20Description: http://sigma.octopart.com:80/conflict_mineral_statement/Yageo-company-3.pdf?src-supplier=Compliance+Statements; ComponentLink21URL: http://sigma.octopart.com:80/rohs_statement/Yageo-company-2.pdf?src-supplier=Compliance+Statements; ComponentLink21Description: http://sigma.octopart.com:80/rohs_statement/Yageo-company-2.pdf?src-supplier=Compliance+Statements; Supplier 1: DigiKey; Supplier Part Number 1: 311-1.00MHRCT-ND
U2 = TLV9002QDRQ1: IC OPAMP GP 2 CIRCUIT 8SOIC / General Purpose Amplifier 2 Circuit Rail-to-Rail 8-SOIC; Manufacturer: Texas Instruments; Manufacturer Lifecycle Status: ACTIVE; Number of Channels: 2; Supplier: DigiKey; Supplier Part Number: 296-TLV9002QDRQ1CT-ND; Manufacturer Part Number: TLV9002QDRQ1; RoHS: Compliant; Category: Amplifiers - Op Amps, Buffer, Instrumentation; Stock: 6623; Pricing: 1=0.85, 10=0.605, 25=0.5448, 100=0.4781, 250=0.44628, 500=0.42712, 1000=0.41157 (USD); Case/Package: SOIC; Height: 1.75mm; Length: 4.9mm; Lifecycle Status: Production; Pins: 8; Thickness: 1.58mm; Width: 3.91mm; ComponentLink1URL: https://octopart.com:443/opatz8j6/c1?t=qNF0SmTfBXis5KuBjHu_0Lw95Gt-ppfX15eU3m0_OURFg7j8CzT1s6WowRPHsWIZbws3EfKsRzYBH_TRpeCcHToL-R8J8UZv9V6Wb1InHiIF8k8Y35NGcowJXJUYI1pnD5fADJ0R8GDNKVUWtLRHCqAGovzBPeiRsuxY5ipn9AhUhRmeYe6-OEpKfd42lu5pCk4HkhVEFD2Mur4YXRhcDV4Iflc8CkCZrl32D2A_m-0JnDbSslzSoAr2XFTf6lypRU0dY9KGNUak8fQ6OqAy5KWwSyRqBFS9rqoF33jhrK8rQgwd-x-Rf5GN-l31P0z1b0gEpQmPDdC7yH2zrnDiFm3LW_bWGcyYXUOocwlnj5ahD-Q0gTJopkT0i_QUuv2BzVg-w33TaJf5&src-supplier=Texas+Instruments; ComponentLink1Description: https://octopart.com:443/opatz8j6/c1?t=qNF0SmTfBXis5KuBjHu_0Lw95Gt-ppfX15eU3m0_OURFg7j8CzT1s6WowRPHsWIZbws3EfKsRzYBH_TRpeCcHToL-R8J8UZv9V6Wb1InHiIF8k8Y35NGcowJXJUYI1pnD5fADJ0R8GDNKVUWtLRHCqAGovzBPeiRsuxY5ipn9AhUhRmeYe6-OEpKfd42lu5pCk4HkhVEFD2Mur4YXRhcDV4Iflc8CkCZrl32D2A_m-0JnDbSslzSoAr2XFTf6lypRU0dY9KGNUak8fQ6OqAy5KWwSyRqBFS9rqoF33jhrK8rQgwd-x-Rf5GN-l31P0z1b0gEpQmPDdC7yH2zrnDiFm3LW_bWGcyYXUOocwlnj5ahD-Q0gTJopkT0i_QUuv2BzVg-w33TaJf5&src-supplier=Texas+Instruments; ComponentLink2URL: https://datasheet.octopart.com:443/TLV9002QDRQ1-Texas-Instruments-datasheet-164419143.pdf?src-supplier=Augswan; ComponentLink2Description: https://datasheet.octopart.com:443/TLV9002QDRQ1-Texas-Instruments-datasheet-164419143.pdf?src-supplier=Augswan; ComponentLink3URL: http://sigma.octopart.com:80/reach_statement/Texas-Instruments-company-64.pdf?src-supplier=Compliance+Statements; ComponentLink3Description: http://sigma.octopart.com:80/reach_statement/Texas-Instruments-company-64.pdf?src-supplier=Compliance+Statements; ComponentLink4URL: http://sigma.octopart.com:80/conflict_mineral_statement/Texas-Instruments-company-63.pdf?src-supplier=Compliance+Statements; ComponentLink4Description: http://sigma.octopart.com:80/conflict_mineral_statement/Texas-Instruments-company-63.pdf?src-supplier=Compliance+Statements; Supplier 1: DigiKey; Supplier Part Number 1: 296-TLV9002QDRQ1CT-ND